# Altium project SI1153 PCB_Project1.PrjPCB
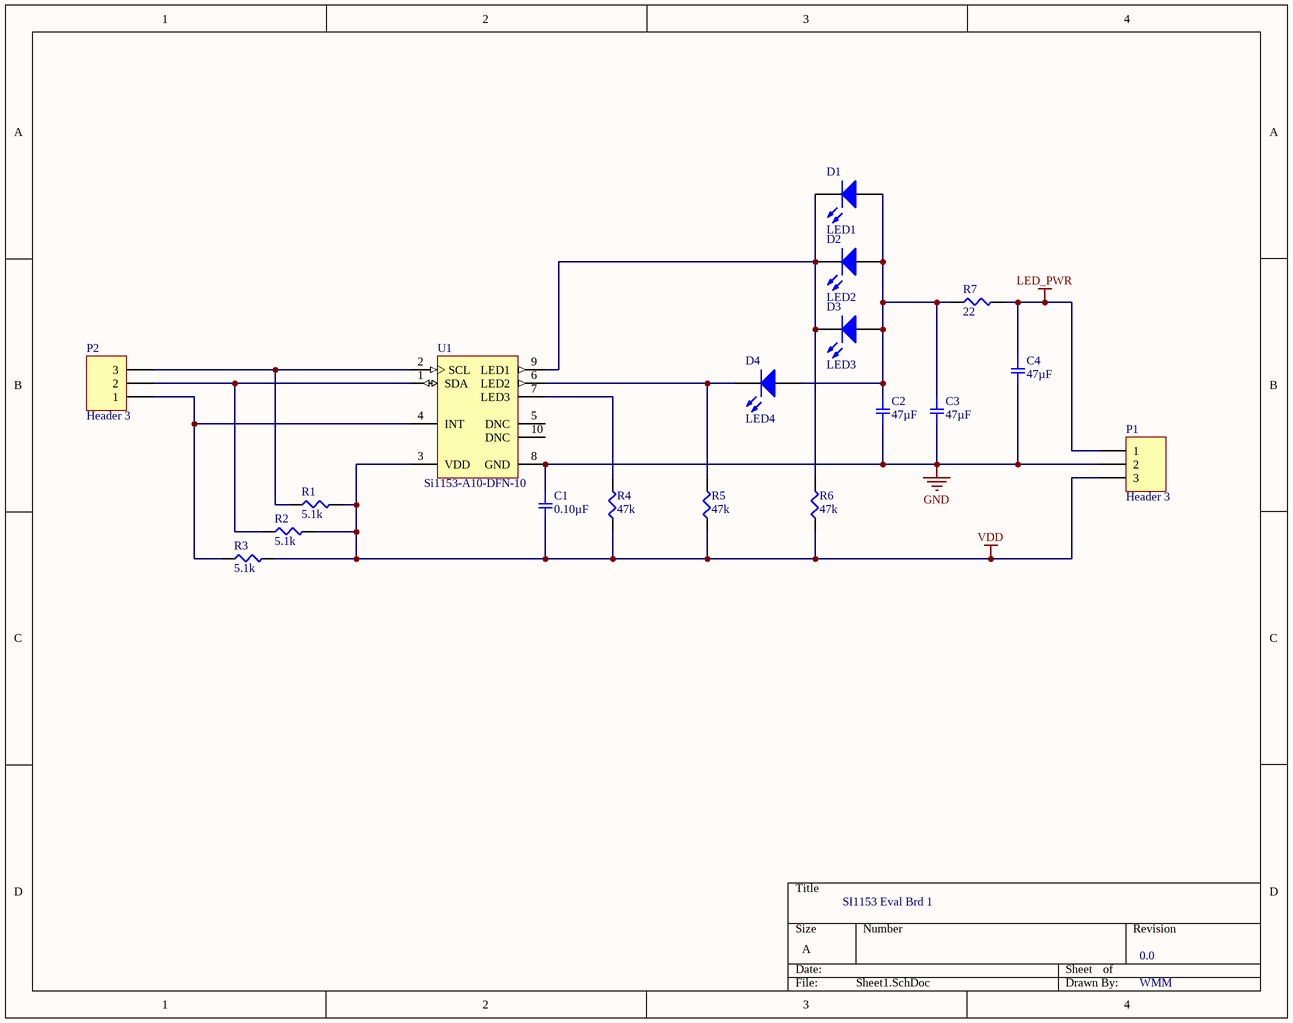
[diagram p0: Sheet1.SchDoc]
1 sheet, 18 parts. Net scope: global (net labels, ports and power ports of the same name join across sheets).
Board file: Si1153 Eval PCB1.PcbDoc

## Sheet Sheet1.SchDoc
size A

### Parts
C1  0.10µF  [SMD-0402C]
C2  47µF  [SMD-0603C]
C3  47µF  [SMD-0603C]
C4  47µF  [SMD-0603C]
D1  LED1  [3.5X2.8X1.9]
D2  LED2  [3.5X2.8X1.9]
D3  LED3  [3.5X2.8X1.9]
D4  LED4  [3.5X2.8X1.9]
P1  Header 3  [HDR1X3]
P2  Header 3  [HDR1X3]
R1  5.1k  [SMD-0402-RES]
R2  5.1k  [SMD-0402-RES]
R3  5.1k  [SMD-0402-RES]
R4  47k  [SMD-0402-RES]
R5  47k  [SMD-0402-RES]
R6  47k  [SMD-0402-RES]
R7  22  [SMD-0402-RES]
U1  Si1153-A10-DFN-10  [SLAB-QFN-10_V]

### Nets
GND: C1.1 C2.2 C3.2 C4.2 P1.2 U1.8(GND)
LED_PWR: C4.1 P1.1 R7.2
VDD: C1.2 P1.3 R1.2 R2.2 R3.2 R4.1 R5.1 R6.1 U1.3(VDD)
NetC2_1: C2.1 C3.1 D1.1(A) D2.1(A) D3.1(A) D4.1(A) R7.1
NetD1_2: D1.2(K) D2.2(K) D3.2(K) R6.2 U1.9(LED1)
NetD4_2: D4.2(K) R5.2 U1.6(LED2)
NetP2_1: P2.1 R3.1 U1.4(INT)
NetP2_2: P2.2 R2.1 U1.1(SDA)
NetP2_3: P2.3 R1.1 U1.2(SCL)
NetR4_2: R4.2 U1.7(LED3)

Not connected (* = marked no-connect by the designer): U1 5(DNC) 10(DNC)

### Notes on the sheet
- SI1153 Eval Brd 1
- 0.0
- WMM

### Library data of the parts
C1 = GCM155R71C104KA55D: CAP CER 0.1UF 16V X7R 0402; Manufacturer: Murata Electronics North America; Factory Stock: 0; Unit Price (USD): 0.1; Minimum Quantity: 1; Tolerance: ±10%; Datasheets: http://www.murata.com/~/media/webrenewal/support/library/catalog/products/capacitor/mlcc/c03e.ashx; Image: //media.digikey.com/Renders/Murata%20Renders/ZRB-SERIES-0402.jpg; Digi-Key Part Number: 490-4759-1-ND; Part Number: GCM155R71C104KA55D; Quantity Available: 734194; @ qty: 0; Packaging: Cut Tape (CT); Series: GCM; Part Status: Active; Value: 0.10µF; Voltage: 16V; Temperature Coefficient: X7R; Operating Temperature: -55°C ~ 125°C; Features: -; Ratings: AEC-Q200; Applications: Automotive; Mounting Type: Surface Mount, MLCC; Package / Case: 0402 (1005 Metric); Size / Dimension: 0.039" L x 0.020" W (1.00mm x 0.50mm); Height - Seated (Max): -; Thickness (Max): 0.022" (0.55mm); Lead Spacing: -; Lead Style: -
C2-C4 = ZRB18AR60J476ME01L: CAP CER 47UF 6.3V X5R 0603; Manufacturer: Murata Electronics North America; Factory Stock: 0; Unit Price (USD): 0.62; Minimum Quantity: 1; Tolerance: ±20%; Datasheets: http://psearch.en.murata.com/capacitor/product/ZRB18AR60J476ME01%23.pdf; Image: //media.digikey.com/Renders/Murata%20Renders/ZRB-SERIES-0603.jpg; Digi-Key Part Number: 490-13255-1-ND; Part Number: ZRB18AR60J476ME01L; Quantity Available: 4130; @ qty: 0; Packaging: Cut Tape (CT); Series: ZRB; Part Status: Active; Value: 47µF; Voltage: 6.3V; Temperature Coefficient: X5R; Operating Temperature: -55°C ~ 85°C; Features: Derating Recommended, Interposer Termination; Ratings: -; Applications: Acoustic Noise Reduction; Mounting Type: Surface Mount, MLCC; Package / Case: 0603 (1608 Metric); Size / Dimension: 0.063" L x 0.031" W (1.60mm x 0.80mm); Height - Seated (Max): -; Thickness (Max): 0.047" (1.20mm); Lead Spacing: -; Lead Style: -
D1-D4 = LED3: Typical BLUE SiC LED; Published: 8-Jun-2000; LatestRevisionDate: 17-Dec-2003; LatestRevisionNote: PCB Footprint replaced.; DatasheetVersion: 16-Apr-2002; PackageVersion: 16-Apr-2002; PackageReference: 3.5X2.8X1.9; Publisher: Altium Limited; PackageDescription: SM LED; 2 C-Bend Leads; Body 3.5 x 2.8 x 1.9 mm, inc leads (LxWxH typ)
P1 P2 = Header 3: Header, 3-Pin; LatestRevisionDate: 17-Jul-2002; LatestRevisionNote: Re-released for DXP Platform.; Publisher: Altium Limited
R1-R3 = ERJ-2GEJ512X: RES SMD 5.1K OHM 5% 1/10W 0402; Manufacturer: Panasonic Electronic Components; Factory Stock: 0; Unit Price (USD): 0.00350; @ qty: 1500; Minimum Quantity: 1; Power (Watts): 0.1W, 1/10W; Temperature Coefficient: ±200ppm/°C; Part Number: ERJ-2GEJ512X; Datasheets: http://industrial.panasonic.com/www-cgi/jvcr13pz.cgi?E+PZ+3+AOA0001+ERJ2GEJ512X+7+WW; Image: //media.digikey.com/Photos/Panasonic%20Photos/ERJ-PA2-Series.jpg; Digi-Key Part Number: P5.1KJCT-ND; Quantity Available: 153265; Packaging: Cut Tape (CT); Series: ERJ; Part Status: Active; Value: 5.1k; Tolerance: ±5%; Composition: Thick Film; Features: Automotive AEC-Q200; Operating Temperature: -55°C ~ 155°C; Package / Case: 0402 (1005 Metric); Supplier Device Package: 0402; Size / Dimension: 0.039" L x 0.020" W (1.00mm x 0.50mm); Height - Seated (Max): 0.016" (0.40mm); Number of Terminations: 2; Failure Rate: -
R4-R6 = ERJ-2GEJ473X: RES SMD 47K OHM 5% 1/10W 0402; Manufacturer: Panasonic Electronic Components; Factory Stock: 0; Unit Price (USD): 0.00350; @ qty: 1500; Minimum Quantity: 1; Power (Watts): 0.1W, 1/10W; Temperature Coefficient: ±200ppm/°C; Part Number: ERJ-2GEJ473X; Datasheets: http://industrial.panasonic.com/www-cgi/jvcr13pz.cgi?E+PZ+3+AOA0001+ERJ2GEJ473X+7+WW; Image: //media.digikey.com/Photos/Panasonic%20Photos/ERJ-PA2-Series.jpg; Digi-Key Part Number: P47KJCT-ND; Quantity Available: 5182645; Packaging: Cut Tape (CT); Series: ERJ; Part Status: Active; Value: 47k; Tolerance: ±5%; Composition: Thick Film; Features: Automotive AEC-Q200; Operating Temperature: -55°C ~ 155°C; Package / Case: 0402 (1005 Metric); Supplier Device Package: 0402; Size / Dimension: 0.039" L x 0.020" W (1.00mm x 0.50mm); Height - Seated (Max): 0.016" (0.40mm); Number of Terminations: 2; Failure Rate: -
R7 = ERJ-2GEJ220X: RES SMD 22 OHM 5% 1/10W 0402; Manufacturer: Panasonic Electronic Components; Factory Stock: 0; Unit Price (USD): 0.00350; @ qty: 1500; Minimum Quantity: 1; Power (Watts): 0.1W, 1/10W; Temperature Coefficient: ±200ppm/°C; Part Number: ERJ-2GEJ220X; Datasheets: http://industrial.panasonic.com/www-cgi/jvcr13pz.cgi?E+PZ+3+AOA0001+ERJ2GEJ220X+7+WW; Image: //media.digikey.com/Photos/Panasonic%20Photos/ERJ-PA2-Series.jpg; Digi-Key Part Number: P22JCT-ND; Quantity Available: 1147502; Packaging: Cut Tape (CT); Series: ERJ; Part Status: Active; Value: 22; Tolerance: ±5%; Composition: Thick Film; Features: Automotive AEC-Q200; Operating Temperature: -55°C ~ 155°C; Package / Case: 0402 (1005 Metric); Supplier Device Package: 0402; Size / Dimension: 0.039" L x 0.020" W (1.00mm x 0.50mm); Height - Seated (Max): 0.016" (0.40mm); Number of Terminations: 2; Failure Rate: -
U1 = Si1143-A10-GMR: Proximity / Ambient Light Sensor IC with I2C Interface, 3 LED Drivers, -40 to 85 degC, 10-pin QFN, Tape and Reel; Manufacturer: Silicon Labs; Ambient Light Sensor: TRUE; Sub-Family: Optical Sensors; DatasheetVersion: Rev. 1.3; PackageReference: QFN-10; PackageDescription: 10-Pin Quad-Flat No-Leads Package, Body 2 x 2 mm, Pitch 0.5 mm; Supplier 1: Digi-Key; Supplier Part Number 1: 336-1970-2-ND; Supplier 2: Digi-Key; Supplier Part Number 2: 336-1970-1-ND; Supplier 3: Digi-Key; Supplier Part Number 3: 336-1970-6-ND; Supplier 4: Mouser; Supplier Part Number 4: 634-SI1143-A10-GMR; Output Type: I2C; Packing: Tape and Reel; Mounting Technology: Surface Mount; Code_JEDEC: MO-220; Code_IPC: J-STD-020; PartNumber: Si1143-A10-GMR; ComponentLink1Description: Manufacturer URL; ComponentLink1URL: http://www.silabs.com; ComponentLink2Description: Datasheet; ComponentLink2URL: http://www.silabs.com/Support%20Documents/TechnicalDocs/Si114x.pdf; ComponentLink3Description: Package Specification; ComponentLink3URL: http://www.silabs.com/Support%20Documents/TechnicalDocs/Si114x.pdf